# EAGLE schematic PMB (EAGLE 9.2.2)
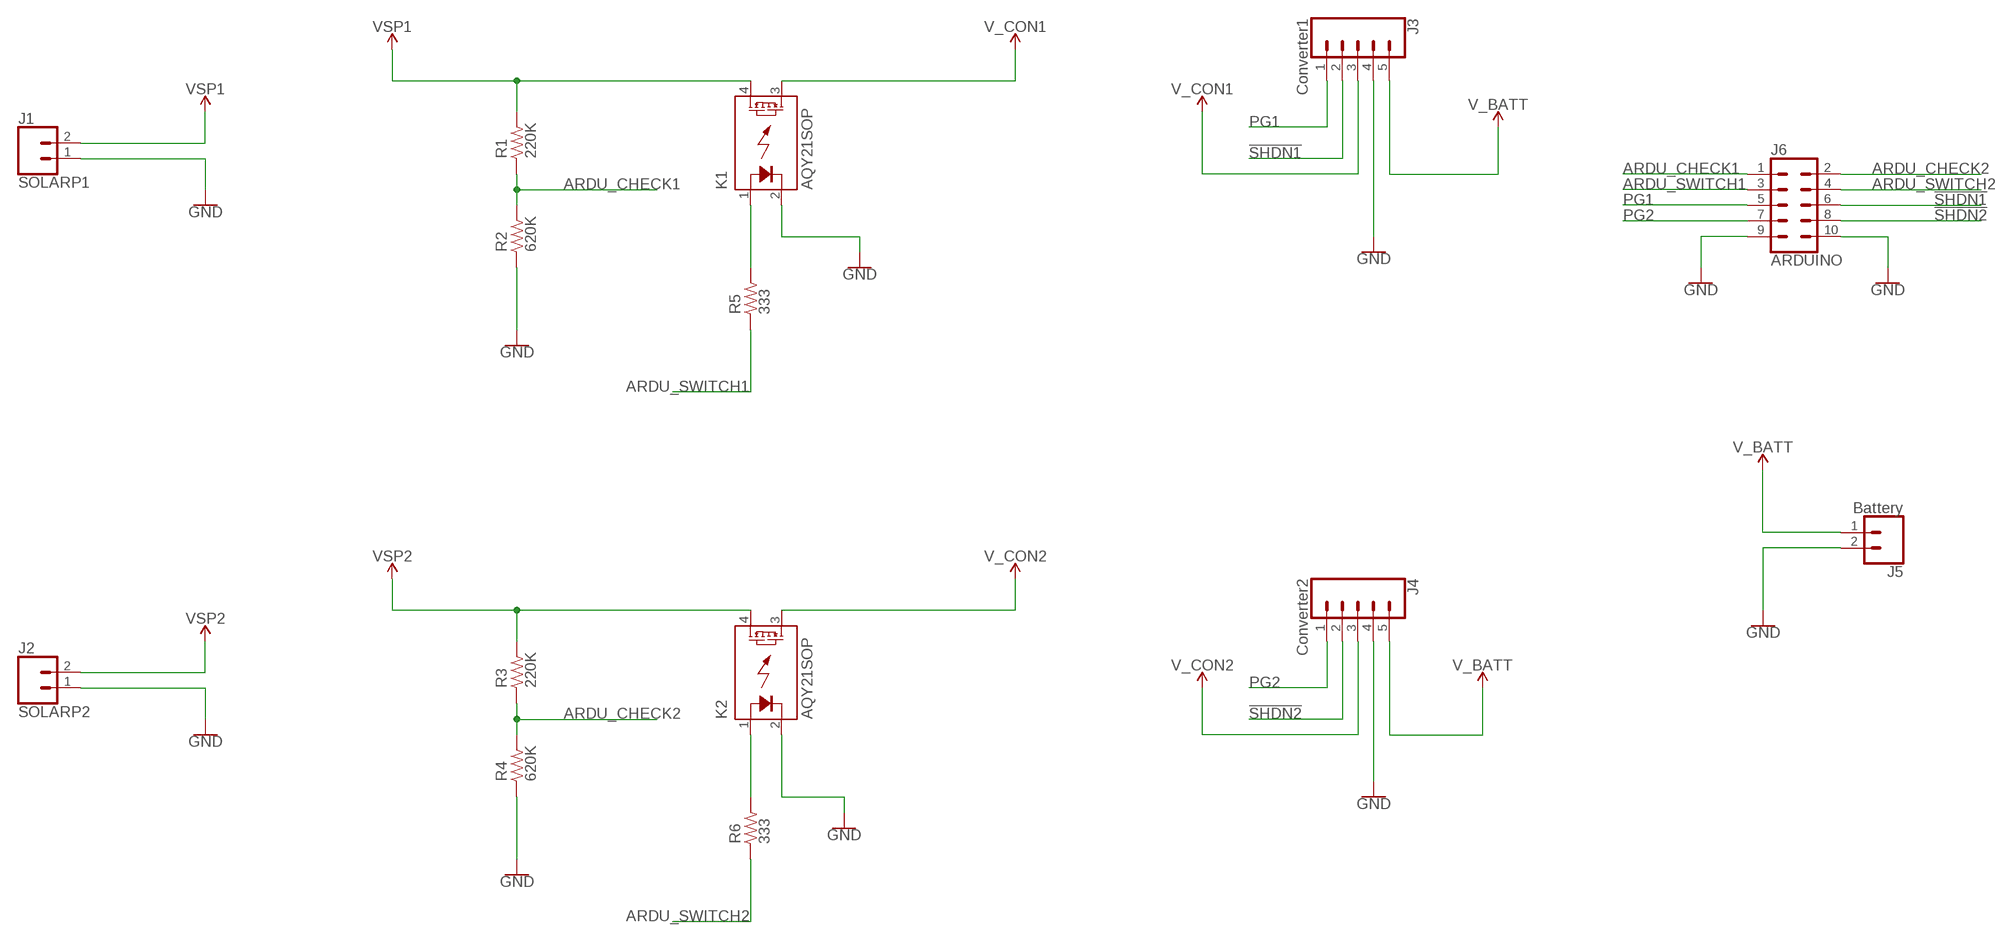
[diagram p0: schematic, sheet 1]

## Parts
J1  SOLARP1  CONN_02PTH3  [1X02_LONGPADS]
J2  SOLARP2  CONN_02PTH3  [1X02_LONGPADS]
J3  Converter1  CONN_05PTH_LONGPADS  [1X05_LONGPADS]
J4  Converter2  CONN_05PTH_LONGPADS  [1X05_LONGPADS]
J5  Battery  CONN_02LOCK_LONGPADS  [1X02_LOCK_LONGPADS]
J6  ARDUINO  CONN_05X2PTH  [2X5]
K1  AQY21SOP  [SOP04]
K2  AQY21SOP  [SOP04]
R1  220K  R_1206  [R1206]
R2  620K  R_1206  [R1206]
R3  220K  R_1206  [R1206]
R4  620K  R_1206  [R1206]
R5  333  R_1206  [R1206]
R6  333  R_1206  [R1206]

## Nets
!SHDN1: J3.2 J6.6
!SHDN2: J4.2 J6.8
ARDU_CHECK1: J6.1 R1.1 R2.2
ARDU_CHECK2: J6.2 R3.1 R4.2
ARDU_SWITCH1: J6.3 R5.1
ARDU_SWITCH2: J6.4 R6.1
GND: J1.1 J2.1 J3.4 J4.4 J5.2 J6.9 J6.10 K1.2(K) K2.2(K) R2.1 R4.1
N$1: K1.1(A) K2.1(A) R5.2 R6.2
PG1: J3.1 J6.5
PG2: J4.1 J6.7
V_BATT: J3.5 J4.5 J5.1
VCC: J2.2 K2.4(DS1) R3.2 ; supply symbol labelled VSP2
VCC_1: J1.2 K1.4(DS1) R1.2 ; supply symbol labelled VSP1
VCC_2: J3.3 K1.3(DS2) ; supply symbol labelled V_CON1
VIN: J4.3 K2.3(DS2) ; supply symbol labelled V_CON2

## Library data of the parts
J1 J2 J5 = SparkFun-Connectors:CONN_02: Multi connection point. Often used as Generic Header-pin footprint for 0.1 inch spaced/style header connections On any of the 0.1 inch spaced packages, you can populate with these: Break Away Headers - Straight <https://www.sparkfun.com/products/116> (PRT-00116) Break Away Male Headers - Right Angle <https://www.sparkfun.com/products/553> (PRT-00553) Female Headers <https://www.sparkfun.com/products/115> (PRT-00115) Break Away Headers - Machine Pin <https://www.sparkfun.com/products/117> (PRT-00117) Break Away Female Headers - Swiss Machine Pin <https://www.sparkfun.com/products/743> (PRT-00743) For SCREWTERMINALS and SPRING TERMINALS visit here: Screw Terimnals on SparkFun.com <https://www.sparkfun.com/search/results?term=Screw+Terminals> (5mm/3.5mm/2.54mm spacing) This device is also useful as a general connection point to wire up your design to another part of your project. Our various solder wires solder well into these plated through hole pads. Hook-Up Wire - Assortment (Stranded, 22 AWG) <https://www.sparkfun.com/products/11375> (PRT-11375) Hook-Up Wire - Assortment (Solid Core, 22 AWG) <https://www.sparkfun.com/products/11367> (PRT-11367) View the entire wire category on our website here <https://www.sparkfun.com/categories/141> Special notes: Molex polarized connector foot print use with: PRT-08233 with associated crimp pins and housings. 2.54_SCREWTERM for use with PRT-10571. 3.5mm Screw Terminal footprints for PRT-08084 5mm Screw Terminal footprints for use with PRT-08432
J3 J4 = SparkFun-Connectors:CONN_05: Multi connection point. Often used as Generic Header-pin footprint for 0.1 inch spaced/style header connections On any of the 0.1 inch spaced packages, you can populate with these: Break Away Headers - Straight <https://www.sparkfun.com/products/116> (PRT-00116) Break Away Male Headers - Right Angle <https://www.sparkfun.com/products/553> (PRT-00553) Female Headers <https://www.sparkfun.com/products/115> (PRT-00115) Break Away Headers - Machine Pin <https://www.sparkfun.com/products/117> (PRT-00117) Break Away Female Headers - Swiss Machine Pin <https://www.sparkfun.com/products/743> (PRT-00743) For SCREWTERMINALS and SPRING TERMINALS visit here: Screw Terimnals on SparkFun.com <https://www.sparkfun.com/search/results?term=Screw+Terminals> (5mm/3.5mm/2.54mm spacing) This device is also useful as a general connection point to wire up your design to another part of your project. Our various solder wires solder well into these plated through hole pads. Hook-Up Wire - Assortment (Stranded, 22 AWG) <https://www.sparkfun.com/products/11375> (PRT-11375) Hook-Up Wire - Assortment (Solid Core, 22 AWG) <https://www.sparkfun.com/products/11367> (PRT-11367) View the entire wire category on our website here <https://www.sparkfun.com/categories/141> Special notes: Molex polarized connector foot print use with SKU : PRT-08231 with associated crimp pins and housings. 1MM SMD Version SKU: PRT-10208
J6 = SparkFun-Connectors:CONN_05X2: Multi connection point. Often used as Generic Header-pin footprint for 0.1 inch spaced/style header connections For AVR SPI programming port, see special device with nice symbol: "AVR_SPI_PROG_5x2.dev" You can populate with any combo of single row headers, but if you'd like an exact match, check these: 2x5 AVR ICSP Male Header <https://www.sparkfun.com/products/778> (PRT-00778) 2x5 Pin Shrouded Header <https://www.sparkfun.com/products/8506> (PRT-08506) On any of the 0.1 inch spaced packages, you can populate with these: Break Away Headers - Straight <https://www.sparkfun.com/products/116> (PRT-00116) Break Away Male Headers - Right Angle <https://www.sparkfun.com/products/553> (PRT-00553) Female Headers <https://www.sparkfun.com/products/115> (PRT-00115) Break Away Headers - Machine Pin <https://www.sparkfun.com/products/117> (PRT-00117) Break Away Female Headers - Swiss Machine Pin <https://www.sparkfun.com/products/743> (PRT-00743) Special note: the shrouded connector mates well with our 5x2 ribbon cables: 2x5 Pin IDC Ribbon Cable <https://www.sparkfun.com/products/8535> (PRT-08535); PROD_ID: CONN-08499; SF_ID: PRT-0778
K1 K2 = relay:AQY*: PhotoMOS Relay NAiS Source: http://www.panasonic-electric-works.com/catalogues/downloads/photomos/ds_x615_en_aqz10_20.pdf; OC_FARNELL: unknown; OC_NEWARK: unknown
R1-R6 = rc-master-smd:R_: RESISTOR